# EasyEDA Pro project thermostat_hardwork.epro

# Schematic Schematic1
Create Date: 2024-04-29; Page Name: P1; Project Name: 恒温箱; Schematic Name: Schematic1; Update Date: 2024-04-30; Page Size: A3; Version: V1.0
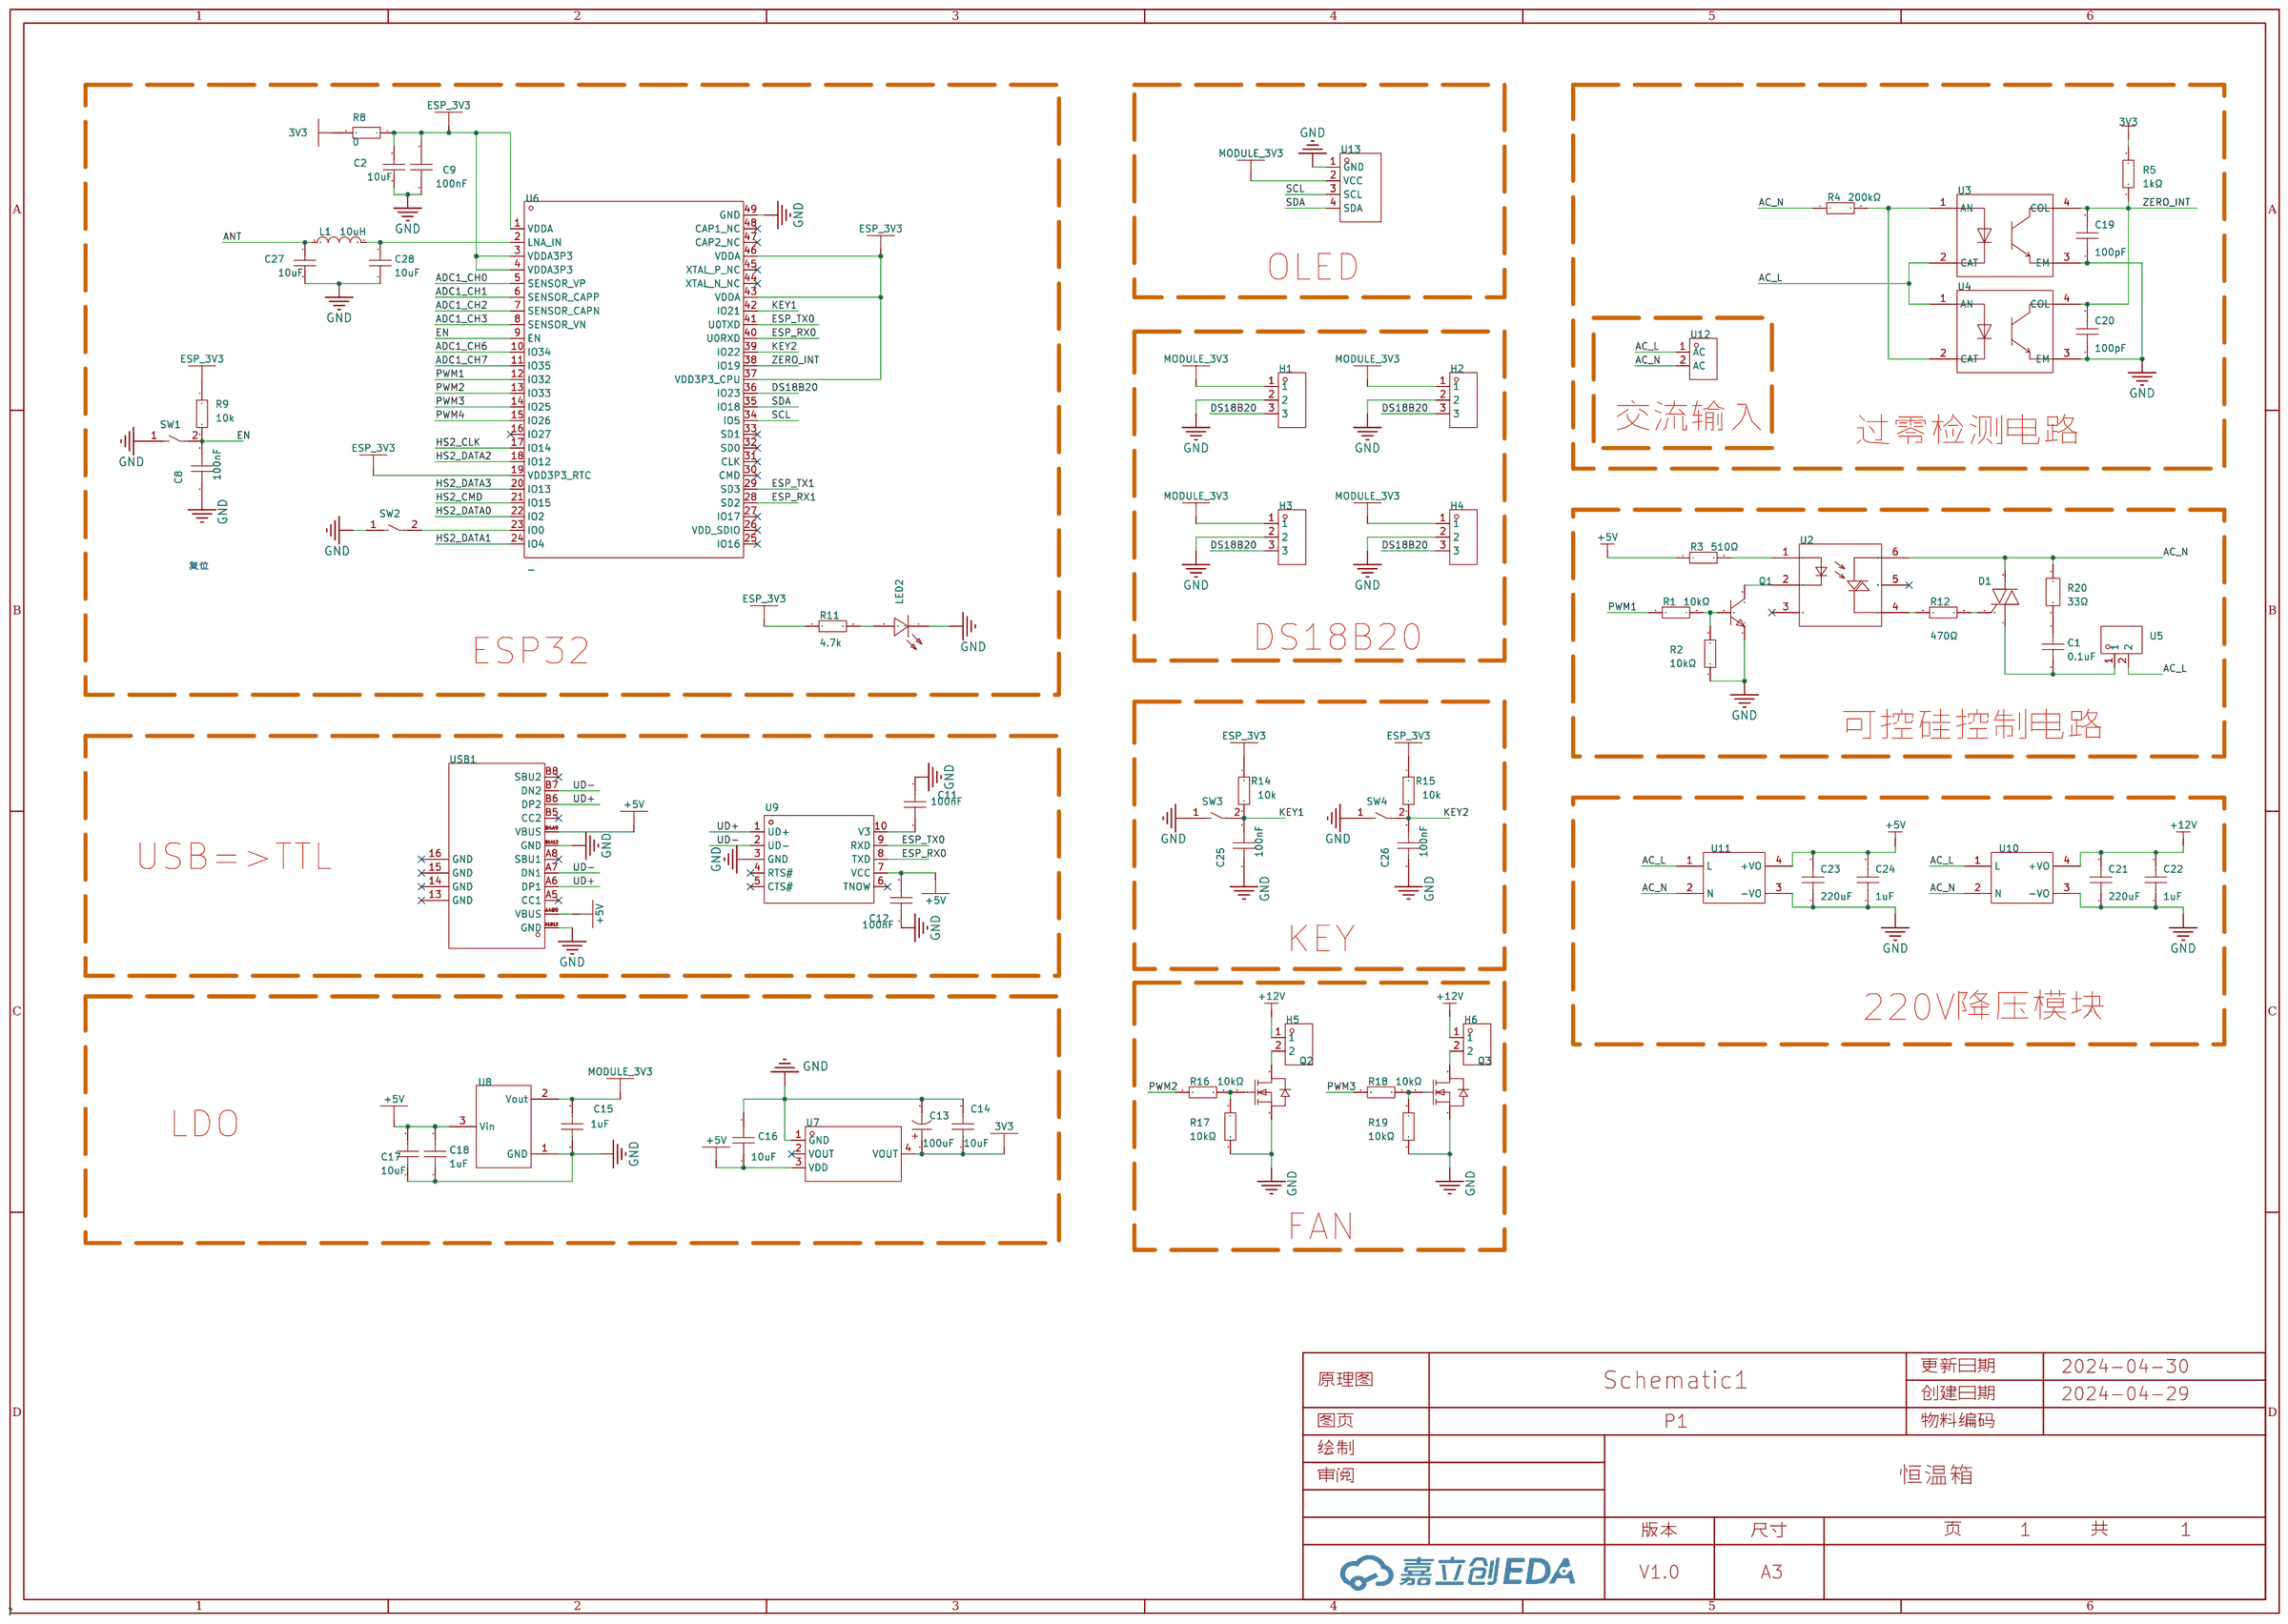
[diagram p0: schematic sheet]

## Parts
C1  0.1uF  [C1210]
C2  10uF  [C0402]
C8  100nF  [C0402]
C9  100nF  [C0402]
C11  100nF  [C0402]
C12  100nF  [C0402]
C13  100uF  [cap-smd_l3.5-w2.8-fd]
C14  10uF  [c0603]
C15  1uF  [C0402]
C16  10uF  [c0603]
C17  10uF  [c0603]
C18  1uF  [C0402]
C19  100pF  [C0402]
C20  100pF  [C0402]
C21  220uF  [C0402]
C22  1uF  [C0402]
C23  220uF  [C0402]
C24  1uF  [C0402]
C25  100nF  [C0402]
C26  100nF  [C0402]
C27  10uF  [C0402]
C28  10uF  [C0402]
D1  BT136S  [TO-252-3_L6.5-W5.8-P4.58-BL]
H1  PZ254V-11-03P  [HDR-TH_3P-P2.54-V-M]
H2  PZ254V-11-03P  [HDR-TH_3P-P2.54-V-M]
H3  PZ254V-11-03P  [HDR-TH_3P-P2.54-V-M]
H4  PZ254V-11-03P  [HDR-TH_3P-P2.54-V-M]
H5  PZ254V-11-02P  [HDR-TH_2P-P2.54-V-M]
H6  PZ254V-11-02P  [HDR-TH_2P-P2.54-V-M]
L1  10uH  [L0603]
LED2  -  [led0402-rd]
Q1  S8050  [SOT-23-3_L2.9-W1.3-P1.90-LS2.4-BR]
Q2  AO3400A  [SOT-23-3_L2.9-W1.6-P1.90-LS2.8-BR]
Q3  AO3400A  [SOT-23-3_L2.9-W1.6-P1.90-LS2.8-BR]
R1  10kΩ  [R0603]
R2  10kΩ  [R0603]
R3  510Ω  [R0603]
R4  200kΩ  [R0603]
R5  1kΩ  [R0603]
R8  0  [r0402]
R9  10k  [r0402]
R11  4.7k  [r0402]
R12  470Ω  [R1206]
R14  10k  [r0402]
R15  10k  [r0402]
R16  10kΩ  [R0603]
R17  10kΩ  [R0603]
R18  10kΩ  [R0603]
R19  10kΩ  [R0603]
R20  33Ω  [RES-SMD_L6.4-W3.2-R2512]
SW1  -  [sw-smd_l4.0-w2.9-ls5.0]
SW2  -  [sw-smd_l4.0-w2.9-ls5.0]
SW3  -  [sw-smd_l4.0-w2.9-ls5.0]
SW4  -  [sw-smd_l4.0-w2.9-ls5.0]
U2  MOC3052SM  [SMD-6_L7.1-W6.5-P2.54-LS10.3-TL]
U3  TLP521-1XSM  [SMD-4_L4.6-W6.5-P2.54-LS10.2-BL]
U4  TLP521-1XSM  [SMD-4_L4.6-W6.5-P2.54-LS10.2-BL]
U5  KF7.62-2P(green)  [CONN-TH_2P-P7.62_KEFA_KF7.62-2P]
U6  -  [qfn-48_l7.0-w7.0-p0.50-bl-ep5.4_2]
U7  -  [sot-223_l6.5-w3.5-p2.30-ls7.0-br]
U8  -  [SOT-23-3_L2.9-W1.6-P1.90-LS2.8-BR]
U9  -  [MSOP-10_L3.0-W3.0-P0.50-LS5.0-BL]
U10  -  [GJ_W_]
U11  -  [GJ_W_]
U12  RT-C06-A1B-AC  [CONN-TH_LEGION_RT-C06-A1B-AC]
U13  HS96L03W2C03  [OLED-TH_L27.8-W27.2-P2.54_C9900033791]
USB1  -  [USB-C-SMD_TYPEC-304-BCP16]

## Library data of the parts
C1 = C3225C0G2E103JT000N: 容值:10nF;精度:±5%;额定电压:250V;材质(温度系数):C0G;; LCSC Part Name: 10nF ±5% 250V; Supplier Part: C342725; Manufacturer: TDK; Supplier Footprint: 1210; JLCPCB Part Class: 扩展库; Datasheet: https://atta.szlcsc.com/upload/public/pdf/source/20191028/C441477_722A9436F63B689BB01D466E49BFBC99.pdf; Supplier: LCSC; Tolerance: ±5%; Voltage Rated: 250V; Temperature Coefficient: C0G
C2 C27 C28 = CC0402MRX5R5BB106: 容值:10uF;精度:±20%;额定电压:6.3V;温度系数:X5R;; LCSC Part Name: 10uF ±20% 6.3V; Supplier Part: C105884; Manufacturer: YAGEO(国巨); Supplier Footprint: 0402; JLCPCB Part Class: Extended Part; Datasheet: https://atta.szlcsc.com/upload/public/pdf/source/20170728/C105884_1501225684064848716.pdf; Supplier: LCSC; Tolerance: ±20%; Voltage Rated: 6.3V; Temperature Coefficient: X5R
C8 C9 C11 C12 C19-C26 = CC0402JRX7R7BB104: 容值:100nF;精度:±5%;额定电压:16V;温度系数:X7R;; LCSC Part Name: 100nF ±5% 16V; Supplier Part: C541464; Manufacturer: YAGEO(国巨); Supplier Footprint: 0402; JLCPCB Part Class: Extended Part; Datasheet: https://atta.szlcsc.com/upload/public/pdf/source/20200615/C541464_B57AABC9570B6B2CE091E735F96B12C0.pdf; Supplier: LCSC; Tolerance: ±5%; Voltage Rated: 16V; Temperature Coefficient: X7R
C13 = CA45B-B-6.3V-100uF-M: 容值:100uF;精度:±20%;额定电压:6.3V;等效串联电阻:-;工作温度:-55~+125;; LCSC Part Name: 100uF ±20% 6.3V; Supplier Part: C688948; Manufacturer: CEC(振华新云); Supplier Footprint: SMD; JLCPCB Part Class: Extended Part; Datasheet: https://atta.szlcsc.com/upload/public/pdf/source/20200701/C688948_1FC438FC63FEA69AA99F86026A33A9DC.pdf; Supplier: LCSC; Tolerance: ±20%; Rated Voltage: 6.3V; Operating Temperature: -55~+125
C14 C16 C17 = CL10A106KP8NNNC: 容值:10uF;精度:±10%;额定电压:10V;温度系数:X5R;; LCSC Part Name: 10uF ±10% 10V; Supplier Part: C19702; Manufacturer: SAMSUNG(三星); Supplier Footprint: 0603; JLCPCB Part Class: Basic Part; Datasheet: https://atta.szlcsc.com/upload/public/pdf/source/20160103/1457707703378.pdf; Supplier: LCSC; Tolerance: ±10%; Voltage Rated: 10V; Temperature Coefficient: X5R
C15 C18 = GRM155Z71A105KE01D: 容值:1uF;精度:±10%;额定电压:10V;温度系数:X7R;; LCSC Part Name: 1uF ±10% 10V; Supplier Part: C528974; Manufacturer: muRata(村田); Supplier Footprint: 0402; JLCPCB Part Class: Extended Part; Datasheet: https://atta.szlcsc.com/upload/public/pdf/source/20200508/C528974_15BC5D9F0CC13FAE313D74FE55DE6D9B.pdf; Supplier: LCSC; Tolerance: ±10%; Voltage Rated: 10V; Temperature Coefficient: X7R
D1 = BT136S: 长电双向可控硅; Supplier Part: C23427; Manufacturer: CJ(江苏长电/长晶); Supplier Footprint: TO-252-2(DPAK); JLCPCB Part Class: 扩展库; Datasheet: https://atta.szlcsc.com/upload/public/pdf/source/20131225/1457706665454.pdf; Supplier: LCSC
H1-H4 = PZ254V-11-03P: 插针结构:1x3P;间距:2.54mm;行距:-;圆针/方针:方针;安装类型:直插;排数:单排;总PIN位数:3P;额定电流:3A;额定电压:250V;配合针长度:6mm;塑高:2.5mm;端接针长度:3mm;工作温度范围:-40℃~+105℃;颜色:黑色;; LCSC Part Name: 间距:2.54mm 1x3P 直插 方针; Supplier Part: C2937625; Manufacturer: XFCN(兴飞); Supplier Footprint: 插件,P=2.54mm; JLCPCB Part Class: 扩展库; Datasheet: https://atta.szlcsc.com/upload/public/pdf/source/20200309/C492402_8335C3D49C4E4C618838D59BB1D024C1.pdf; Supplier: LCSC; Pin Structure: 1x3P; Pitch: 2.54mm; Circluar Pins/Square Pins: 方针; Mounting Type: 直插; Number of Rows: 单排; Number of Pins: 3P; Current Rating (Max): 3A; Voltage Rating (Max): 250V; Length of Mating Pin: 6mm; Insulation Height: 2.5mm; Length of End Connection Pin: 3mm; Operating Temperature Range: -40℃~+105℃; Color: 黑色
H5 H6 = PZ254V-11-02P: 插针结构:1x2P;间距:2.54mm;行距:-;圆针/方针:方针;安装类型:直插;排数:单排;总PIN位数:2P;额定电流:-;额定电压:-;配合针长度:6mm;塑高:2.5mm;端接针长度:3mm;触头材质:黄铜;触头镀层:-;工作温度范围:-40℃~+105℃;颜色:黑色;; LCSC Part Name: 间距:2.54mm 1x2P 直插 方针; Supplier Part: C492401; Manufacturer: XFCN(兴飞); Supplier Footprint: 插件,P=2.54mm; JLCPCB Part Class: 扩展库; Datasheet: https://atta.szlcsc.com/upload/public/pdf/source/20200309/C492401_A812433581A9B211A7FFA413ADDFF0E5.pdf; Supplier: LCSC; Pin Structure: 1x2P; Pitch: 2.54mm; Circluar Pins/Square Pins: 方针; Mounting Type: 直插; Number of Rows: 单排; Number of Pins: 2P; Length of Mating Pin: 6mm; Insulation Height: 2.5mm; Length of End Connection Pin: 3mm; Contact Material: 黄铜; Operating Temperature Range: -40℃~+105℃; Color: 黑色
L1 = AHW1608FE100KTF: 电感值:10uH;精度:±10%;额定电流:280mA;直流电阻(DCR):2.4Ω;; LCSC Part Name: 10uH ±10%; Supplier Part: C6808014; Manufacturer: APV(爱普微); Supplier Footprint: 0603; JLCPCB Part Class: 扩展库; Datasheet: https://atta.szlcsc.com/upload/public/pdf/source/20230801/BB08BAF005D51D8CB3E22DF937F0D567.pdf; Supplier: LCSC; Tolerance: ±10%; Rated Current: 280mA; DC Resistance (DCR): 2.4Ω; Q @ Freq: 14; Frequency - Self Resonant: 36MHz; Type: 绕线片式电感
LED2 = NCD0402G1: 发光颜色:翠绿;; LCSC Part Name: 翠绿; Supplier Part: C130723; Manufacturer: 国星光电; Supplier Footprint: 0402; JLCPCB Part Class: Extended Part; Datasheet: https://atta.szlcsc.com/upload/public/pdf/source/20200820/C130723_D39B4171A1B8D8D2F39C1DC521C0922A.pdf; Supplier: LCSC; Emitted Color: 翠绿
Q1 = S8050_C2891804: 晶体管类型:NPN;集电极电流(Ic):500mA;集射极击穿电压(Vceo):25V;功率(Pd):300mW;; LCSC Part Name: NPN 电流:500mA 耐压:25V; Supplier Part: C2891804; Manufacturer: YONGYUTAI(永裕泰); Supplier Footprint: SOT-23; JLCPCB Part Class: 扩展库; Datasheet: https://atta.szlcsc.com/upload/public/pdf/source/20210901/5347316A10609C628D4D69AE01446E5B.pdf; Supplier: LCSC; Transistor Type: NPN; Collector Current (Ic): 500mA; Collector-Emitter Breakdown Voltage (Vceo): 25V; Power Dissipation (Pd): 300mW; Collector Cut-Off Current (Icbo): 1uA; Collector-Emitter Saturation Voltage (VCE(sat)@Ic,Ib): 500mV@500mA,50mA
Q2 Q3 = AO3400A_C20917: 类型:1个N沟道;漏源电压(Vdss):30V;连续漏极电流(Id):5.7A;功率(Pd):1.4W;导通电阻(RDS(on)@Vgs,Id):26.5mΩ@10V,5.7A;阈值电压(Vgs(th)@Id):1.5V@250uA;; LCSC Part Name: 1个N沟道 耐压:30V 电流:5.7A; Supplier Part: C20917; Manufacturer: AOS; Supplier Footprint: SOT-23-3L; JLCPCB Part Class: 基础库; Datasheet: https://atta.szlcsc.com/upload/public/pdf/source/20140107/1457706668533.pdf; Supplier: LCSC; Type: 1个N沟道; Drain Source Voltage (Vdss): 30V; Continuous Drain Current (Id): 5.7A; Power Dissipation (Pd): 1.4W; Drain Source On Resistance (RDS(on)@Vgs,Id): 26.5mΩ@10V,5.7A; Gate Threshold Voltage (Vgs(th)@Id): 1.5V@250uA; Total Gate Charge (Qg@Vgs): 7nC@4.5V; Input Capacitance (Ciss@Vds): 630pF@15V; Operating Temperature: -55℃~+150℃@(Tj)
R1-R3 R16-R19 = 0603WAF1002T5E: 电阻类型:厚膜电阻;阻值:10kΩ;精度:±1%;功率:100mW;最大工作电压:75V;温度系数:±100ppm/℃;; LCSC Part Name: 厚膜电阻 10kΩ ±1% 100mW; Supplier Part: C25804; Manufacturer: UNI-ROYAL(厚声); Supplier Footprint: 0603; JLCPCB Part Class: 基础库; Datasheet: https://atta.szlcsc.com/upload/public/pdf/source/20200306/C422600_1E6D84923E4A46A82E41ADD87F860B5C.pdf; Supplier: LCSC; Type: 厚膜电阻; Tolerance: ±1%; Power(Watts): 100mW; Overload Voltage (Max): 75V; Temperature Coefficient: ±100ppm/℃; Operating Temperature Range: -55℃~+155℃
R4 = 0603WAF2003T5E: 电阻类型:厚膜电阻;阻值:200kΩ;精度:±1%;功率:100mW;最大工作电压:75V;温度系数:±100ppm/℃;; LCSC Part Name: 200kΩ ±1% 100mW 厚膜电阻; Supplier Part: C25811; Manufacturer: UNI-ROYAL(厚声); Supplier Footprint: 0603; JLCPCB Part Class: 基础库; Datasheet: https://atta.szlcsc.com/upload/public/pdf/source/20200306/C422600_1E6D84923E4A46A82E41ADD87F860B5C.pdf; Supplier: LCSC; Type: 厚膜电阻; Tolerance: ±1%; Power(Watts): 100mW; Overload Voltage (Max): 75V; Temperature Coefficient: ±100ppm/℃; Operating Temperature Range: -55℃~+155℃
R5 = RC0603FR-071KL: 电阻类型:厚膜电阻;阻值:1kΩ;精度:±1%;功率:100mW;最大工作电压:75V;温度系数:±100ppm/℃;; LCSC Part Name: 厚膜电阻 1kΩ ±1% 100mW; Supplier Part: C22548; Manufacturer: YAGEO(国巨); Supplier Footprint: 0603; JLCPCB Part Class: 扩展库; Datasheet: https://atta.szlcsc.com/upload/public/pdf/source/20180316/70C0E2BDAE7FCC62C531A5A58D202EE1.pdf; Supplier: LCSC; Type: 厚膜电阻; Tolerance: ±1%; Power(Watts): 100mW; Overload Voltage (Max): 75V; Temperature Coefficient: ±100ppm/℃; Operating Temperature Range: -55℃~+155℃
R8 = 0402WGJ0000TCE: 电阻类型:厚膜电阻;阻值:0;精度:±5%;功率:1/16W;温度系数:-;最大工作电压:50V;工作温度范围:-55~+155;; LCSC Part Name: 0 ±5%; Supplier Part: C21376; Manufacturer: UNI-ROYAL(厚声); Supplier Footprint: 0402; JLCPCB Part Class: Extended Part; Datasheet: https://atta.szlcsc.com/upload/public/pdf/source/20200306/C422600_1E6D84923E4A46A82E41ADD87F860B5C.pdf; Supplier: LCSC; Type: 厚膜电阻; Tolerance: ±5%; Power(Watts): 1/16W; Overload Voltage (Max): 50V; Operating Temperature Range: -55~+155
R9 R14 R15 = AC0402FR-0710KL: 电阻类型:厚膜电阻;阻值:10k;精度:±1%;功率:62.5mW;温度系数:±100ppm/;最大工作电压:50V;工作温度范围:-55~+155;; LCSC Part Name: 10k ±1%; Supplier Part: C144807; Manufacturer: YAGEO(国巨); Supplier Footprint: 0402; JLCPCB Part Class: Extended Part; Datasheet: https://atta.szlcsc.com/upload/public/pdf/source/20171225/C144807_15141880815031202999.pdf; Supplier: LCSC; Type: 厚膜电阻; Tolerance: ±1%; Power(Watts): 62.5mW; Temperature Coefficient: ±100ppm/; Overload Voltage (Max): 50V; Operating Temperature Range: -55~+155
R11 = AC0402FR-074K7L: 电阻类型:厚膜电阻;阻值:4.7k;精度:±1%;功率:62.5mW;温度系数:±100ppm/;最大工作电压:50V;工作温度范围:-55~+155;; LCSC Part Name: 4.7k ±1%; Supplier Part: C174364; Manufacturer: YAGEO(国巨); Supplier Footprint: 0402; JLCPCB Part Class: Extended Part; Datasheet: https://atta.szlcsc.com/upload/public/pdf/source/20180125/C174364_15168701759061304793.pdf; Supplier: LCSC; Type: 厚膜电阻; Tolerance: ±1%; Power(Watts): 62.5mW; Temperature Coefficient: ±100ppm/; Overload Voltage (Max): 50V; Operating Temperature Range: -55~+155
R12 = 1206W4F220JT5E: 电阻类型:厚膜电阻;阻值:22Ω;精度:±1%;功率:250mW;最大工作电压:200V;温度系数:±100ppm/℃;; LCSC Part Name: 22Ω ±1% 250mW 厚膜电阻; Supplier Part: C17958; Manufacturer: UNI-ROYAL(厚声); Supplier Footprint: 1206; JLCPCB Part Class: 基础库; Datasheet: https://atta.szlcsc.com/upload/public/pdf/source/20200306/C422600_1E6D84923E4A46A82E41ADD87F860B5C.pdf; Supplier: LCSC; Type: 厚膜电阻; Tolerance: ±1%; Power(Watts): 250mW; Overload Voltage (Max): 200V; Temperature Coefficient: ±100ppm/℃; Operating Temperature Range: -55℃~+155℃
R20 = HoJLR2512-3W-10mR-1%: 电阻类型:采样电阻;阻值:10mΩ;精度:±1%;功率:3W;安装方式:贴片;; LCSC Part Name: 10mΩ ±1% 3W; Supplier Part: C2903468; Manufacturer: Milliohm(毫欧); Supplier Footprint: 2512; JLCPCB Part Class: 扩展库; Datasheet: https://atta.szlcsc.com/upload/public/pdf/source/20211009/7525CABAB363C979E942C1DD41F1FEF0.pdf; Supplier: LCSC; Type: 采样电阻; Tolerance: ±1%; Power(Watts): 3W; Mounting Sytle: 贴片
SW1-SW4 = TS342A2P 250gf-WZ 021: 3*4正按小龟 2脚/两脚贴片小龟 无柱/不带柱; LCSC Part Name: 轻触开关 正按小龟 3*4*2mm 两脚不带柱 250gf 黑色塑胶按钮; Supplier Part: C2906285; Manufacturer: SHOU HAN(首韩); Supplier Footprint: SMD; JLCPCB Part Class: Extended Part; Datasheet: https://atta.szlcsc.com/upload/public/pdf/source/20211019/B0840D9D2EDA6B165E59EB2CD177CDC8.pdf; Supplier: LCSC
U2 = MOC3052SM: Supplier Part: C3014301; Manufacturer: UMW(友台半导体); Supplier Footprint: SOP-6-6.5mm; JLCPCB Part Class: 扩展库; Datasheet: https://atta.szlcsc.com/upload/public/pdf/source/20231109/FEF2BBB42FEEF1333F7A621F5DB25FD4.pdf; Supplier: LCSC
U3 U4 = TLP521-1XSM: 输入电压类型:DC;正向电压:1.15V;输出电流:50mA;隔离电压(rms):5.3kV;反向电压:6V;接收端电压:55V;输出通道数:1;集射极饱和电压(Vce(sat)@Ic,IF):400mV@2.4mA,8mA;; LCSC Part Name: DC输入 隔离电压(rms):5300V; Supplier Part: C83157; Manufacturer: ISOCOM(英国安数光); Supplier Footprint: SMD-4P; JLCPCB Part Class: 扩展库; Datasheet: https://atta.szlcsc.com/upload/public/pdf/source/20181205/C83157_755450129BF4CC137580CACDD5B9451F.pdf; Supplier: LCSC; Input voltage type: DC; Output Type: 光电三极管; Forward Voltage: 1.15V; Output Current: 50mA; Isolation Voltage(rms): 5.3kV; Reverse Voltage: 6V; Receiving End Voltage: 55V; Number of Outputs: 1; Collector-Emitter Saturation Voltage (Vce(sat)@Ic,IF): 400mV@2.4mA,8mA; Rise time: 4us@2mA,100Ω; Fall time: 3us@2mA,100Ω; Operating Temperature: -30℃~+100℃
U5 = KF7.62-2P(green): LCSC Part Name: KF7.62-2P(green) 绿色尼龙环保; Supplier Part: C5173665; Manufacturer: KEFA(科发); Supplier Footprint: 插件,P=7.62mm; JLCPCB Part Class: 扩展库; Datasheet: https://atta.szlcsc.com/upload/public/pdf/source/20220915/0842C98F0805CE3BBD42ED115252704B.pdf; Supplier: LCSC
U6 = ESP32-PICO-D4: 类型:-;作业频率:-;输出功率:-;接口类型:-;工作电压:-;; Supplier Part: C193707; Manufacturer: ESPRESSIF 乐鑫; Supplier Footprint: QFN-48_7x7x05P; JLCPCB Part Class: Extended Part; Datasheet: https://atta.szlcsc.com/upload/public/pdf/source/20180531/C193707_20E6BADDB6EC95F0C0D505BA515D2866.pdf; Supplier: LCSC
U7 = BL8071CLBTR33: 输出类型:-;; Supplier Part: C2763399; Manufacturer: BL(上海贝岭); Supplier Footprint: SOT-223(B); JLCPCB Part Class: Extended Part; Datasheet: https://atta.szlcsc.com/upload/public/pdf/source/20210326/C2763399_673FCA3A6B3A739A2977F0E56E5ED7A1.pdf; Supplier: LCSC
U8 = XC6206P332MR_C5446: 输出类型:固定;输出极性:正;输出通道数:1;最大输入电压:6V;输出电压:3.3V;压差:680mV@(100mA);输出电流:200mA;电源纹波抑制比(PRSS):-;; LCSC Part Name: Vin=6V Vout=3.3V 200mA; Supplier Part: C5446; Manufacturer: TOREX(特瑞仕); Manufacturer Part: XC6206P332MR; Supplier Footprint: SOT-23-3L; JLCPCB Part Class: Basic Part; Datasheet: https://atta.szlcsc.com/upload/public/pdf/source/20130801/1457706628791.pdf; Supplier: LCSC; Output Type: 固定; Output Polarity: 正; Number of Outputs: 1; Maximum Input Voltage: 6V; Output Voltage: 3.3V; Dropout Voltage: 680mV@(100mA); Output Current: 200mA
U9 = CH340E: 类型:Transceiver;协议类别:USB 2.0;驱动器/接收器数:-;数据速率:2Mbps;; Supplier Part: C99652; Manufacturer: WCH(南京沁恒); Supplier Footprint: MSOP-10; JLCPCB Part Class: Extended Part; Datasheet: https://atta.szlcsc.com/upload/public/pdf/source/20200819/C99652_97FFC0DF2539BFF05CD752AD9221D632.pdf; Supplier: LCSC; Type: Transceiver; Protocol: USB 2.0; Data Rate: 2Mbps; Supply Voltage: 3.3V, 5V
U10 U11 = GJ_W_: 220V降压模块
U12 = RT-C06-A1B-AC_C18221846: 带安规认证米老鼠三孔插座1.Rating：2.5A 250VAC UL CUL; Supplier Part: C18221846; Manufacturer: Legion(六钧); Supplier Footprint: 插件; Datasheet: https://atta.szlcsc.com/upload/public/pdf/source/20231012/B6CE6CE5EB936751B4418C0730F2656A.pdf; Supplier: LCSC
U13 = HS96L03W2C03: 主控芯片:SSD1315;接口类型:I2C;尺寸(inch):0.96;像素分辨率:128x64;; LCSC Part Name: 0.96寸OLED显示屏窄白光IIC; Supplier Part: C5248080; Manufacturer: HS(汉昇); JLCPCB Part Class: 扩展库; Datasheet: https://atta.szlcsc.com/upload/public/pdf/source/20230627/763D01F79A90007632F098068C7C8AD9.pdf; Supplier: LCSC; Main Control Chip: SSD1315; Interface Type: I2C; Size: 0.96; Pixel Resolution: 128x64; Operating Temperature: -40℃~+70℃
USB1 = TYPEC-304-BCP16: 连接器类型:Type-C;标准:USB 3.1;公母:母座;触点数量:16.0;端口数量:1;安装方式:卧贴;额定电流 - 电源:3A;工作温度范围:-25~+85;焊接温度(最大值):260;; Supplier Part: C720629; Manufacturer: XUNPU(讯普); Supplier Footprint: SMD; JLCPCB Part Class: Extended Part; Datasheet: https://atta.szlcsc.com/upload/public/pdf/source/20211022/DACD6552F639E9483017DE6DC0E61150.pdf; Supplier: LCSC; Connector Type: Type-C; Standard: USB 3.1; Gender: 母座; Number of Contacts: 16.0; Number of Ports: 1; Mounting Sytle: 卧贴; Current Rating - Power (Max): 3A; Operating Temperature Range: -25~+85; Welding Temperature (Max): 260

## Nets
3V3: C13.1 C14.1 R5.2 R8.2 U7.4(VOUT)
+5V: C12.2 C16.1 C17.2 C18.2 C23.2 C24.2 R3.1 U7.3(VDD) U8.3(Vin) U9.7(VCC) U11.4(+VO) USB1.A4B9(VBUS) USB1.B4A9(VBUS)
+12V: C21.2 C22.2 H5.1 H6.1 U10.4(+VO)
GND: C2.1 C8.1 C9.1 C11.2 C12.1 C13.2 C14.2 C15.1 C16.2 C17.1 C18.1 C19.1 C20.1 C21.1 C22.1 C23.1 C24.1 C25.1 C26.1 C27.1 C28.1 H1.2 H2.2 H3.2 H4.2 LED2.1(K) Q1.2(E) Q2.2(S) Q3.2(S) R2.1 R17.1 R19.1 SW1.1 SW2.1 SW3.1 SW4.1 U3.3(EM) U4.3(EM) U6.49(GND) U7.1(GND) U8.1(GND) U9.3(GND) U10.3(-VO) U11.3(-VO) U13.1(GND) USB1.A1B12(GND) USB1.B1A12(GND)
AC_L: U3.2(CAT) U4.1(AN) U5.2 U10.1(L) U11.1(L) U12.1(AC)
AC_N: D1.2(M2) R4.1 R20.1 U2.6(Terminal) U10.2(N) U11.2(N) U12.2(AC)
ADC1_CH0: U6.5(SENSOR_VP)
ADC1_CH1: U6.6(SENSOR_CAPP)
ADC1_CH2: U6.7(SENSOR_CAPN)
ADC1_CH3: U6.8(SENSOR_VN)
ADC1_CH6: U6.10(IO34)
ADC1_CH7: U6.11(IO35)
ANT: C27.2 L1.1
DS18B20: H1.3 H2.3 H3.3 H4.3 U6.36(IO23)
EN: C8.2 R9.2 SW1.2 U6.9(EN)
ESP_3V3: C2.2 C9.2 R8.1 R9.1 R11.1 R14.1 R15.1 U6.1(VDDA) U6.3(VDDA3P3) U6.4(VDDA3P3) U6.19(VDD3P3_RTC) U6.37(VDD3P3_CPU) U6.43(VDDA) U6.46(VDDA)
ESP_RX0: U6.40(U0RXD) U9.8(TXD)
ESP_RX1: U6.28(SD2)
ESP_TX0: U6.41(U0TXD) U9.9(RXD)
ESP_TX1: U6.29(SD3)
HS2_CLK: U6.17(IO14)
HS2_CMD: U6.21(IO15)
HS2_DATA0: U6.22(IO2)
HS2_DATA1: U6.24(IO4)
HS2_DATA2: U6.18(IO12)
HS2_DATA3: U6.20(IO13)
KEY1: C25.2 R14.2 SW3.2 U6.42(IO21)
KEY2: C26.2 R15.2 SW4.2 U6.39(IO22)
MODULE_3V3: C15.2 H1.1 H2.1 H3.1 H4.1 U8.2(Vout) U13.2(VCC)
PWM1: R1.1 U6.12(IO32)
PWM2: R16.1 U6.13(IO33)
PWM3: R18.1 U6.14(IO25)
PWM4: U6.15(IO26)
SCL: U6.34(IO5) U13.3(SCL)
SDA: U6.35(IO18) U13.4(SDA)
UD+: U9.1(UD+) USB1.A6(DP1) USB1.B6(DP2)
UD-: U9.2(UD-) USB1.A7(DN1) USB1.B7(DN2)
ZERO_INT: C19.2 C20.2 R5.1 U3.4(COL) U4.4(COL) U6.38(IO19)
$1N600: R3.2 U2.1(AN)
$1N603: Q1.3(C) U2.2(CAT)
$1N629: Q1.1(B) R1.2 R2.2
$1N976: R4.2 U3.1(AN) U4.2(CAT)
$1N1155: R12.1 U2.4(Terminal)
$1N1347: D1.3(G) R12.2
$1N1416: C1.2 D1.1(M1) U5.1
$1N4532: C11.1 U9.10(V3)
$1N4544: LED2.2(A) R11.2
$1N12396: SW2.2 U6.23(IO0)
$1N12986: Q2.1(G) R16.2 R17.2
$1N13035: H5.2 Q2.3(D)
$1N13251: Q3.1(G) R18.2 R19.2
$1N13257: H6.2 Q3.3(D)
$1N15091: C28.2 L1.2 U6.2(LNA_IN)
$1N16886: C1.1 R20.2

Not connected (* = marked no-connect by the designer): U2 3(NC)* 5(Substrate)*; U6 16(IO27)* 25(IO16)* 26(VDD_SDIO)* 27(IO17)* 30(CMD)* 31(CLK)* 32(SD0)* 33(SD1)* 44(XTAL_N_NC)* 45(XTAL_P_NC)* 47(CAP2_NC)* 48(CAP1_NC)*; U7 2(VOUT)*; U9 4(RTS#)* 5(CTS#)* 6(TNOW)*; USB1 13(GND)* 14(GND)* 15(GND)* 16(GND)* A5(CC1)* A8(SBU1)* B5(CC2)* B8(SBU2)*

## Notes on the sheet
- OLED
- 交流输入
- 过零检测电路
- 复位
- DS18B20
- ESP32
- 可控硅控制电路
- USB=>TTL
- KEY
- 220V降压模块
- LDO
- FAN

# Board PCB1
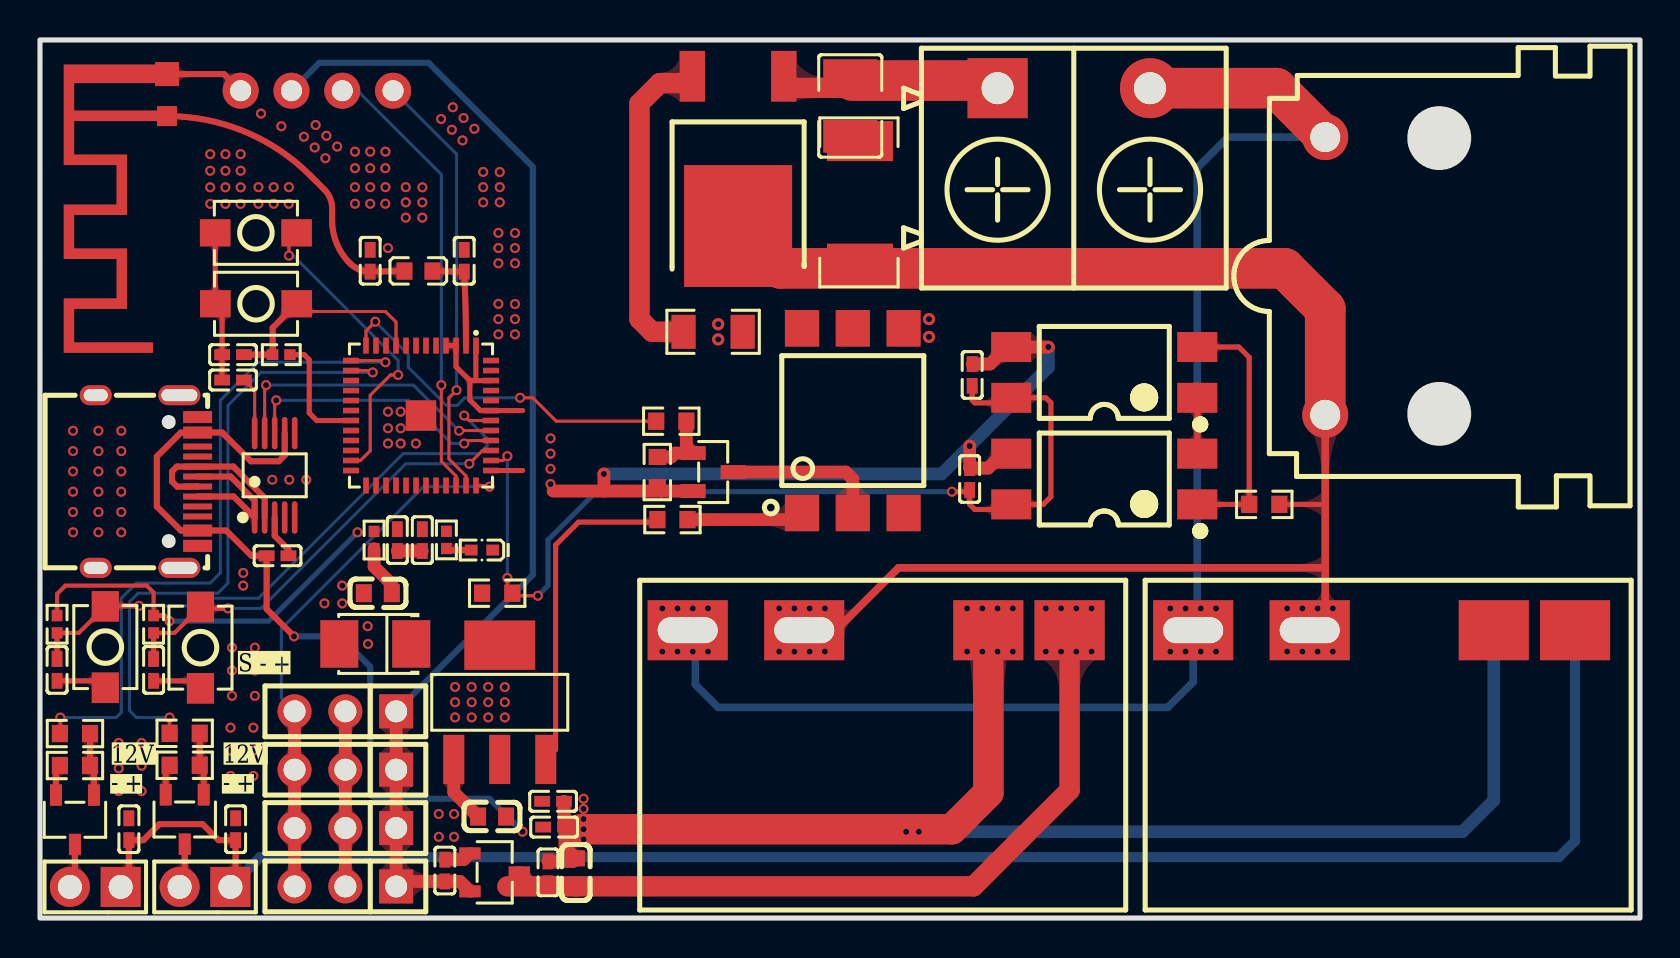
[diagram p1: board, top side]
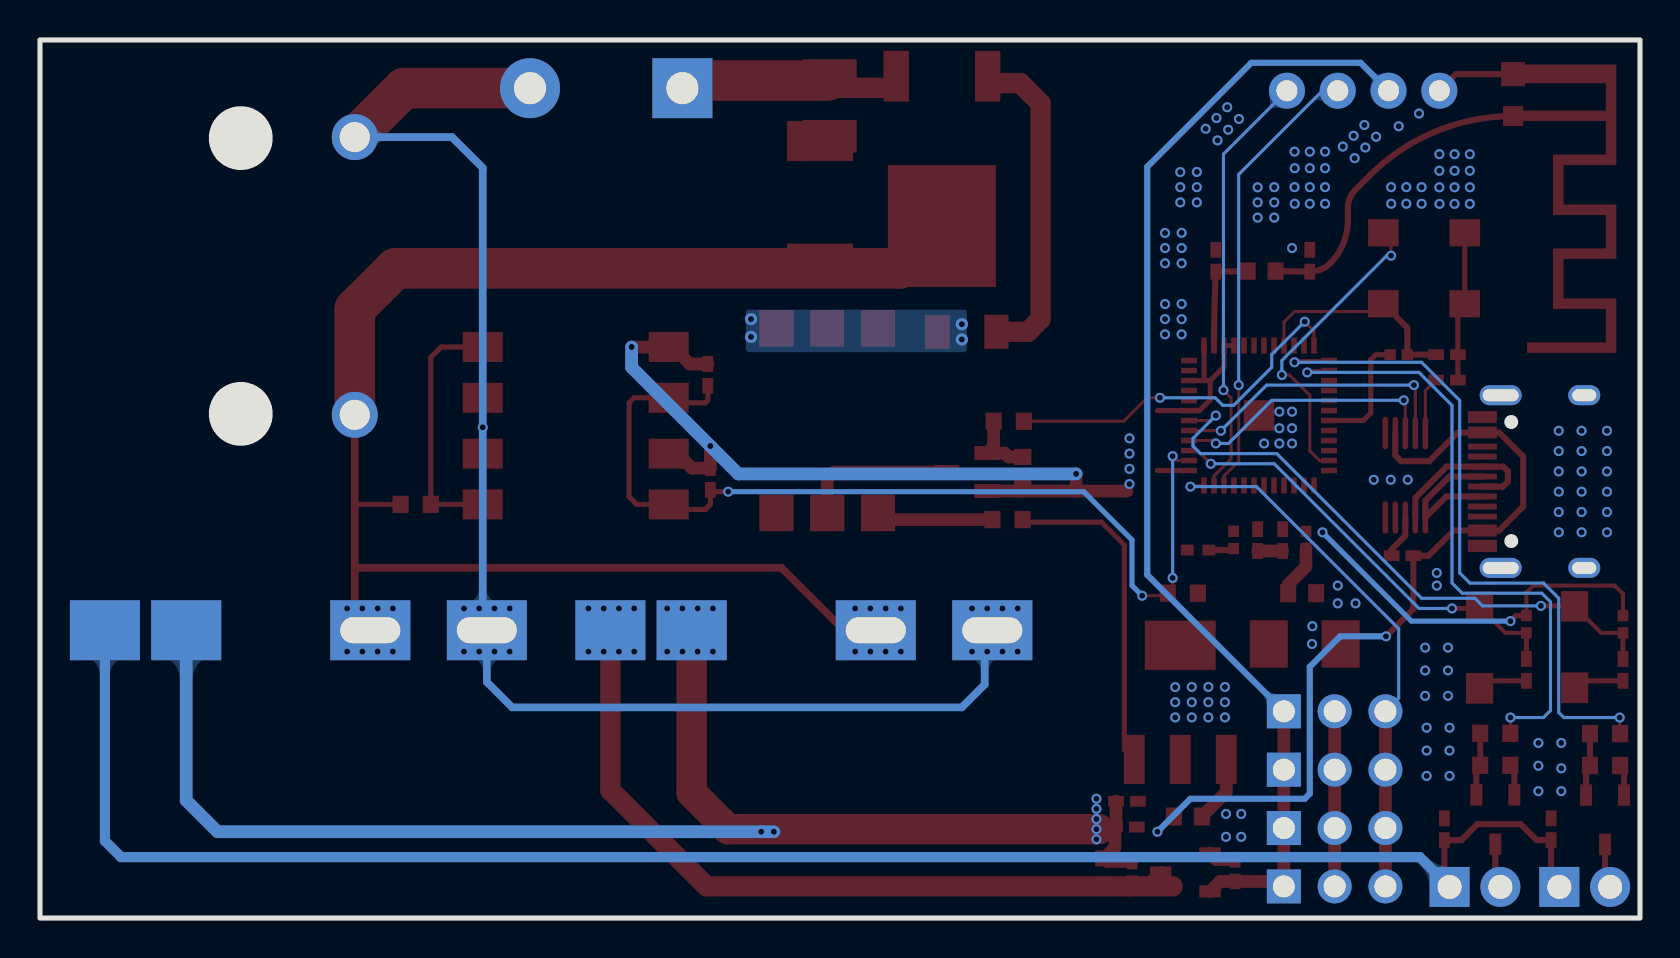
[diagram p2: board, bottom side, seen from below]

Outline 80 x 43.94 mm; copper layers: Top Layer, Bottom Layer. Coordinates in mm from the lower left corner of the outline.
Outline path: rectangle 0,43.94 80,0
Stack: Top Layer 0.035mm / Dielectric1 1.51mm FR4 er 4.5 / Bottom Layer 0.035mm

## Design rules (mm)
template: 自定义配置
spacing copperThickness1oz (default): track to track 0.102, other pairs 0.152 to 0.3
spacing copperThickness2oz: track to track 0.203, other pairs 0.152 to 0.3
track width copperThickness1oz (default): min 0.127, default 0.254, max 2.54
track width copperThickness2oz: min 0.203, default 0.254, max 2.54
differential pair differentialPair (default): width min 0.127, default 0.254, max 2.54; gap min 0.152, default 0.152
via viaSize (default): diameter min 0.5, default 0.61, max 10; hole min 0.3, default 0.305, max 6.3

## Placement (name value [footprint] x y rotation side)
C1  0.1uF  [C1210]  40.51 40.64 90 top
C2  10uF  [C0402]  17.87 18.91 90 top
C8  100nF  [C0402]  9.65 28.19 0 top
C9  100nF  [C0402]  19.12 18.91 90 top
C11  100nF  [C0402]  9.65 26.92 180 top
C12  100nF  [C0402]  11.88 18.13 180 top
C13  100uF  [cap-smd_l3.5-w2.8-fd]  16.76 13.72 180 top
C14  10uF  [c0603]  16.89 16.26 180 top
C15  1uF  [C0402]  20.24 2.38 270 top
C16  10uF  [c0603]  26.8 2.29 90 top
C17  10uF  [c0603]  22.61 5.08 0 top
C18  1uF  [C0402]  25.65 5.84 180 top
C19  100pF  [C0402]  46.61 27.18 270 top
C20  100pF  [C0402]  46.48 21.97 270 top
C21  220uF  [C0402]  9.78 4.45 270 top
C22  1uF  [C0402]  4.45 4.45 270 top
C23  220uF  [C0402]  25.4 2.29 270 top
C24  1uF  [C0402]  25.71 4.55 180 top
C25  100nF  [C0402]  0.85 12.42 90 top
C26  100nF  [C0402]  5.68 12.42 90 top
C27  10uF  [C0402]  16.51 32.89 270 top
C28  10uF  [C0402]  21.21 32.89 270 top
D1  BT136S  [TO-252-3_L6.5-W5.8-P4.58-BL]  34.9 38.38 180 top
DESIGNATOR1  -  [ANT-PCB-2.4G-IFA-AN043-TI-ORIGIN]  6.35 40.13 90 top
H1  PZ254V-11-03P  [HDR-TH_3P-P2.54-V-M]  15.27 1.58 180 top
H2  PZ254V-11-03P  [HDR-TH_3P-P2.54-V-M]  15.27 7.42 180 top
H3  PZ254V-11-03P  [HDR-TH_3P-P2.54-V-M]  15.27 4.5 180 top
H4  PZ254V-11-03P  [HDR-TH_3P-P2.54-V-M]  15.27 10.34 180 top
H5  PZ254V-11-02P  [HDR-TH_2P-P2.54-V-M]  2.76 1.56 180 top
H6  PZ254V-11-02P  [HDR-TH_2P-P2.54-V-M]  8.25 1.56 180 top
L1  10uH  [L0603]  18.92 32.38 0 top
LED2  -  [led0402-rd]  22.1 18.42 180 top
Q1  S8050  [SOT-23-3_L2.9-W1.3-P1.90-LS2.4-BR]  33.66 22.32 180 top
Q2  AO3400A  [SOT-23-3_L2.9-W1.6-P1.90-LS2.8-BR]  1.75 4.92 90 top
Q3  AO3400A  [SOT-23-3_L2.9-W1.6-P1.90-LS2.8-BR]  7.24 4.93 90 top
R1  10kΩ  [R0603]  31.56 24.86 0 top
R2  10kΩ  [R0603]  30.87 22.32 90 top
R3  510Ω  [R0603]  31.62 19.94 0 top
R4  200kΩ  [R0603]  61.21 20.7 180 top
R5  1kΩ  [R0603]  22.86 16.26 180 top
R8  0  [r0402]  16.7 18.91 270 top
R9  10k  [r0402]  12.06 28.19 180 top
R11  4.7k  [r0402]  20.32 18.92 270 top
R12  470Ω  [R1206]  33.66 29.34 180 top
R14  10k  [r0402]  0.85 14.7 270 top
R15  10k  [r0402]  5.68 14.7 270 top
R16  10kΩ  [R0603]  1.75 9.23 0 top
R17  10kΩ  [R0603]  1.75 7.63 0 top
R18  10kΩ  [R0603]  7.24 9.25 0 top
R19  10kΩ  [R0603]  7.24 7.65 0 top
R20  33Ω  [RES-SMD_L6.4-W3.2-R2512]  41 35.81 90 top
SW1  -  [sw-smd_l4.0-w2.9-ls5.0]  10.8 30.74 0 top
SW2  -  [sw-smd_l4.0-w2.9-ls5.0]  10.8 34.29 0 top
SW3  -  [sw-smd_l4.0-w2.9-ls5.0]  3.27 13.56 90 top
SW4  -  [sw-smd_l4.0-w2.9-ls5.0]  8.02 13.53 90 top
U2  MOC3052SM  [SMD-6_L7.1-W6.5-P2.54-LS10.3-TL]  40.64 24.89 90 top
U3  TLP521-1XSM  [SMD-4_L4.6-W6.5-P2.54-LS10.2-BL]  53.21 21.97 90 top
U4  TLP521-1XSM  [SMD-4_L4.6-W6.5-P2.54-LS10.2-BL]  53.21 27.31 90 top
U5  KF7.62-2P(green)  [CONN-TH_2P-P7.62_KEFA_KF7.62-2P]  51.69 41.53 0 top
U6  -  [qfn-48_l7.0-w7.0-p0.50-bl-ep5.4_2]  19.05 25.15 180 top
U7  -  [sot-223_l6.5-w3.5-p2.30-ls7.0-br]  22.99 10.8 270 top
U8  -  [SOT-23-3_L2.9-W1.6-P1.90-LS2.8-BR]  22.73 2.29 180 top
U9  -  [MSOP-10_L3.0-W3.0-P0.50-LS5.0-BL]  11.73 22.16 0 top
U10  -  [GJ_W_]  68.45 10.92 0 top
U11  -  [GJ_W_]  43.18 10.92 0 top
U12  RT-C06-A1B-AC  [CONN-TH_LEGION_RT-C06-A1B-AC]  64.26 32.13 90 top
U13  HS96L03W2C03  [OLED-TH_L27.8-W27.2-P2.54_C9900033791]  13.84 41.4 0 top
USB1  -  [USB-C-SMD_TYPEC-304-BCP16]  5.33 21.84 270 top

## Footprints (pads in the part's own frame, mm; a bottom-side part is the same pattern mirrored in y, then rotated)
ANT-PCB-2.4G-IFA-AN043-TI-ORIGIN
  rect 1x1 smd: 1(0,0)
  rect 1.2x1.2 smd: 2(2.1,0)
C0402
  rect 0.79x0.541 smd: 1(-0.546,0) 2(0.546,0)
c0603
  rect 0.8x0.9 smd: 1(-0.7,0) 2(0.7,0)
C1210
  rect 1.635x2.7 smd: 1(-1.518,0) 2(1.518,0)
cap-smd_l3.5-w2.8-fd
  rect 1.9x2.375 smd: 1(-1.798,0) 2(1.798,0)
CONN-TH_2P-P7.62_KEFA_KF7.62-2P
  rect 3x3 hole 1.6: 1(-3.81,0)
  round 3 hole 1.6: 2(3.81,0)
CONN-TH_LEGION_RT-C06-A1B-AC
  round 2.3 hole 1.5: 1(6.95,0) 2(-6.95,0)
GJ_W_
  rect 4x3 hole 3x1.3: 1(-10.795,3.482) 2(-4.968,3.482)
  rect 3.5x3 hole 0.003: 3(4.237,3.482) 4(8.301,3.482)
  round 0.003 hole 6.2x1.3: 5(6.269,3.482)
HDR-TH_2P-P2.54-V-M
  rect 2x2 hole 1.2: 1(-1.27,0)
  round 2 hole 1.2: 2(1.27,0)
HDR-TH_3P-P2.54-V-M
  rect 1.7x1.7 hole 1.1: 1(-2.54,0)
  round 1.7 hole 1.1: 2(0,0) 3(2.54,0)
L0603
  rect 0.8x0.864 smd: 1(-0.7,0) 2(0.7,0)
led0402-rd
  rect 0.637x0.541 smd: 1(-0.538,0) 2(0.538,0)
MSOP-10_L3.0-W3.0-P0.50-LS5.0-BL
  oval 0.28x1.621 smd: 1(-1.001,-2.111) 2(-0.5,-2.111) 3(0,-2.111) 4(0.5,-2.111) 5(1.001,-2.111) 6(1.001,2.111) 7(0.5,2.111) 8(0,2.111) 9(-0.5,2.111) 10(-1.001,2.111)
OLED-TH_L27.8-W27.2-P2.54_C9900033791
  round 1.8 hole 1.05: 1(-3.81,0) 2(-1.27,0) 3(1.27,0) 4(3.81,0)
qfn-48_l7.0-w7.0-p0.50-bl-ep5.4_2
  rect 0.28x0.8 smd: 1(-2.751,-3.5) 2(-2.251,-3.5) 3(-1.75,-3.5) 4(-1.25,-3.5) 5(-0.75,-3.5) 6(-0.249,-3.5) 7(0.249,-3.5) 8(0.75,-3.5) 9(1.25,-3.5) 10(1.75,-3.5) 11(2.251,-3.5) 12(2.751,-3.5) 25(2.751,3.5) 26(2.251,3.5) 27(1.75,3.5) 28(1.25,3.5) 29(0.75,3.5) 30(0.249,3.5) 31(-0.249,3.5) 32(-0.75,3.5) 33(-1.25,3.5) 34(-1.75,3.5) 35(-2.251,3.5) 36(-2.751,3.5)
  rect 0.8x0.28 smd: 13(3.5,-2.751) 14(3.5,-2.251) 15(3.5,-1.75) 16(3.5,-1.25) 17(3.5,-0.75) 18(3.5,-0.249) 19(3.5,0.249) 20(3.5,0.75) 21(3.5,1.25) 22(3.5,1.75) 23(3.5,2.251) 24(3.5,2.751) 37(-3.5,2.751) 38(-3.5,2.251) 39(-3.5,1.75) 40(-3.5,1.25) 41(-3.5,0.75) 42(-3.5,0.249) 43(-3.5,-0.249) 44(-3.5,-0.75) 45(-3.5,-1.25) 46(-3.5,-1.75) 47(-3.5,-2.251) 48(-3.5,-2.751)
  rect 1.524x1.524 smd: 49(0,0)
r0402
  rect 0.567x0.541 smd: 1(-0.432,0) 2(0.432,0)
R0603
  rect 0.806x0.864 smd: 1(-0.753,0) 2(0.753,0)
R1206
  rect 1.208x1.701 smd: 1(-1.479,0) 2(1.479,0)
RES-SMD_L6.4-W3.2-R2512
  rect 2x3.3 smd: 1(-3.067,0) 2(3.067,0)
SMD-4_L4.6-W6.5-P2.54-LS10.2-BL
  rect 1.5x2 smd: 1(-1.27,-4.65) 2(1.27,-4.65) 3(1.27,4.65) 4(-1.27,4.65)
SMD-6_L7.1-W6.5-P2.54-LS10.3-TL
  rect 1.83x1.71 smd: 1(-4.62,2.54) 2(-4.62,0) 3(-4.62,-2.54) 4(4.62,-2.54) 5(4.62,0) 6(4.62,2.54)
SOT-23-3_L2.9-W1.3-P1.90-LS2.4-BR
  rect 1.25x0.7 smd: 1(1,-0.95) 2(1,0.95) 3(-1,0)
SOT-23-3_L2.9-W1.6-P1.90-LS2.8-BR
  rect 1.069x0.6 smd: 1(1.234,-0.95) 2(1.234,0.95) 3(-1.234,0)
sot-223_l6.5-w3.5-p2.30-ls7.0-br
  rect 2.464x1.049 smd: 1(2.857,-2.299) 2(2.857,0) 3(2.857,2.301)
  rect 2.464x3.541 smd: 4(-2.857,0)
sw-smd_l4.0-w2.9-ls5.0
  rect 1.53x1.36 smd: 1(-2.035,0) 2(2.035,0)
TO-252-3_L6.5-W5.8-P4.58-BL
  rect 1.27x2.54 smd: 1(-2.288,-3.747) 3(2.288,-3.745)
  rect 5.4x6.1 smd: 2(-0.002,3.747)
USB-C-SMD_TYPEC-304-BCP16
  oval 1.001x2.1 hole 0.6x1.801: 13(-4.321,1.633) 14(4.321,1.633)
  oval 1.001x1.6 hole 0.6x1.199: 15(-4.321,-2.547) 16(4.321,-2.547)
  rect 0.6x1.45 smd: A1B12(-3.226,2.547) A4B9(-2.451,2.547) B1A12(3.22,2.547) B4A9(2.451,2.547)
  rect 0.299x1.45 smd: A5(-1.25,2.547) A6(-0.249,2.547) A7(0.249,2.547) A8(1.25,2.547) B5(1.75,2.547) B6(0.75,2.547) B7(-0.75,2.547) B8(-1.75,2.547)

## Nets
As in the schematic, except:
GND: C2.1 C8.1 C9.1 C11.2 C12.1 C13.2 C14.2 C15.1 C16.2 C17.1 C18.1 C19.1 C20.1 C21.1 C22.1 C23.1 C24.1 C25.1 C26.1 C27.1 C28.1 DESIGNATOR1.2 H1.2 H2.2 H3.2 H4.2 LED2.1 Q1.2 Q2.2 Q3.2 R2.1 R17.1 R19.1 SW1.1 SW2.1 SW3.1 SW4.1 U3.3 U4.3 U6.49 U7.1 U8.1 U9.3 U10.3 U11.3 U13.1 USB1.A1B12 USB1.B1A12
ANT: C27.2 DESIGNATOR1.1 L1.1

Pads without a net: U2 3 5; U6 16 25 26 27 30 31 32 33 44 45 47 48; U7 2; U9 4 5 6; U10 5; U11 5; USB1 13 14 15 16 A5 A8 B5 B8

## Via types
v1: diameter 0.5, hole 0.3, Top Layer to Bottom Layer, 225 vias
v2: diameter 0.61, hole 0.305, Top Layer to Bottom Layer, 7 vias

## Routing (per net, layer and track width the routed paths; a pad name or vN(x,y) marks a point on that pad's centre or on a via; arc(x,y) is an arc through that point)
3V3: length 2.6
  Top Layer w0.635: C14.1 17.59,16.7 16.7,17.59 R8.2
+5V: length 97.9
  Top Layer w0.254: R3.1 30.74,19.81 26.92,19.81 25.78,18.67 25.78,8.43 U7.3
  Top Layer w0.305: 12.57,14.22 11.33,15.47 C12.2 10.57,18.13 9.31,19.39 USB1.B4A9 7.04,19.39 5.84,20.59 5.84,23.09 7.04,24.3 USB1.A4B9 9.11,24.3 10.54,22.86 11.94,22.86 12.23,23.16 U9.7
  Top Layer w0.635: U8.3 24.51,1.74 25.4,1.74 25.55,1.59
  Top Layer w1.016: 23.37,1.59 C16.1 46.67,1.59 51.48,6.4 U11.4
  Bottom Layer w0.305: v1(24.13,4.32) 22.48,5.97 16.76,5.97 16.51,6.22 16.51,12.57 14.99,14.1 v1(12.7,14.1)
  vias: v1(50.29,15.49) v1(50.29,13.34) v1(51.05,15.49) v1(51.05,13.34) v1(51.82,15.49) v1(51.82,13.34) v1(52.58,15.49) v1(52.58,13.34)
+12V: length 89.7
  Top Layer w0.305: H5.1 4.45,1.97 C22.2 5.17,3.9 5.97,4.7 8.13,4.7 8.93,3.9 C21.2 9.78,1.81 H6.1
  Bottom Layer w0.508: U10.4 76.75,3.86 75.95,3.05 11.01,3.05 H6.1
GND: length 149.7
  Top Layer w0.254: C26.1 7.65,11.87 SW4.1 ; 9.11,26.92 9.11,30.4 SW1.1 8.76,30.75 SW2.1 ; SW3.1 2.92,11.87 C25.1
  Top Layer w0.305: Q3.2 6.29,7.45 R19.1 ; 0.8,6.15 0.8,7.44 R17.1 ; U13.1 9.2,42.23 6.9,42.23 ; U9.3 11.73,19.13 12.42,18.44 C12.1
  Top Layer w0.635: v2(46.48,23.62) C20.1 47.41,22.52 48.13,23.24 U3.3 ; 28.19,21.37 25.65,21.37 ; 28.19,21.37 v2(28.19,22.23) ; 28.19,21.37 31.06,21.37 ; U7.1 20.69,6.3 C17.1 ; C19.1 47.51,27.72 48.36,28.58 v2(50.42,28.58) ; 31.06,21.37 R2.1 ; 31.06,21.37 Q1.2 ; H4.2 H2.2 H3.2 H1.2 ; U8.1 21.19,2.92 C15.1 ; C2.1 C9.1 ; 26.2,5.84 26.2,4.6 C24.1 26.25,3.53 C16.2 26.64,2.83 C23.1
  Top Layer w1.524: 27.05,4.45 45.59,4.45 47.42,6.27 U11.3
  Bottom Layer w0.635: U10.3 72.69,5.89 71.12,4.32 v1(43.94,4.32) v1(43.31,4.32) ; v2(50.42,28.58) 50.42,27.56 v2(46.48,23.62) 45.09,22.23 v2(28.19,22.23)
  vias: v1(1.65,24.38) v1(1.65,23.37) v1(1.65,22.35) v1(1.65,21.34) v1(1.65,20.32) v1(1.65,19.3) v1(2.92,24.38) v1(2.92,23.37) v1(2.92,22.35) v1(2.92,21.34) v1(2.92,20.32) v1(2.92,19.3) v1(3.94,8.76) v1(3.94,7.49) v1(3.94,6.35) v1(4.06,24.38) v1(4.06,23.37) v1(4.06,22.35) v1(4.06,21.34) v1(4.06,20.32) v1(4.06,19.3) v1(5.08,8.76) v1(5.08,7.62) v1(5.08,6.35) v1(8.51,38.23) v1(8.51,37.4) v1(8.51,36.57) v1(8.51,35.74) v1(9.27,38.23) v1(9.27,37.4) v1(9.27,36.57) v1(9.27,35.74) v1(9.6,13.53) v1(9.6,12.39) v1(9.6,11.12) v1(9.53,9.53) v1(9.53,8.38) v1(9.53,7.11) v1(10.03,38.23) v1(10.03,37.4) v1(10.03,36.57) v1(10.03,35.74) v1(10.16,17.27) v1(10.16,16.64) v1(10.67,9.53) v1(10.67,8.38) v1(10.67,7.11) v1(10.74,13.53) v1(10.74,12.39) v1(10.74,11.12) v1(10.92,36.58) v1(10.92,35.75) v1(11.05,40.26) v1(11.68,36.58) v1(11.68,35.75) v1(11.61,21.93) v1(12.06,39.62) v1(12.45,36.58) v1(12.44,35.75) v1(12.46,21.93) v1(13.2,39.1) v1(13.31,21.93) v1(13.78,39.69) v1(13.73,38.56) v1(14.27,38.03) v1(14.22,15.75) v1(14.32,39.15) v1(14.86,38.61) v1(15.11,16.64) v1(15.11,15.75) v1(15.75,38.35) v1(15.75,37.53) v1(15.75,36.58) v1(15.75,35.75) v1(16.38,14.61) v1(16.4,13.72) v1(16.51,38.35) v1(16.51,37.53) v1(16.51,36.58) v1(16.51,35.75) v1(17.27,38.35) v1(17.27,37.53) v1(17.27,36.58) v1(17.27,35.75) v1(17.4,33.53) v1(17.4,25.34) v1(17.4,24.51) v1(17.4,23.75) v1(18.03,25.34) v1(18.03,24.51) v1(18.03,23.75) v1(18.29,36.58) v1(18.29,35.81) v1(18.29,35.05) v1(18.8,23.75) v1(19.12,36.57) v1(19.12,35.81) v1(19.12,35.05) v1(19.94,5.21) v1(19.94,4.06) v1(20.05,39.99) v1(20.59,39.45) v1(20.64,40.57) v1(20.7,5.21) v1(20.7,4.06) v1(20.75,11.56) v1(20.75,10.8) v1(20.75,10.04) v1(21.18,40.04) v1(21.13,38.92) v1(21.58,11.56) v1(21.58,10.8) v1(21.58,10.04) v1(21.72,39.5) v1(22.16,37.34) v1(22.16,36.58) v1(22.16,35.81) v1(22.41,11.56) v1(22.41,10.8) v1(22.41,10.04) v1(22.99,37.33) v1(22.99,36.58) v1(22.99,35.81) v1(22.92,34.29) v1(22.92,33.53) v1(22.92,32.77) v1(22.92,30.73) v1(22.92,29.97) v1(22.92,29.21) v1(23.24,11.56) v1(23.24,10.8) v1(23.24,10.04) v1(23.75,34.28) v1(23.75,33.53) v1(23.75,32.77) v1(23.75,30.73) v1(23.75,29.97) v1(23.75,29.21) v1(25.53,24) v1(25.53,23.24) v1(25.53,22.48) v1(25.53,21.72) v1(27.18,5.97) v1(27.18,5.46) v1(27.18,4.95) v1(27.18,4.45) v1(27.18,3.94) v1(46.35,15.49) v1(46.35,13.34) v1(47.12,15.49) v1(47.12,13.34) v1(47.88,15.49) v1(47.88,13.34) v1(48.64,15.49) v1(48.64,13.34)
AC_L: length 74.2
  Top Layer w0.305: U3.2 v1(57.86,24.56) U4.1
  Top Layer w2.032: U5.2 61.81,41.53 U12.1
  Bottom Layer w0.381: U11.1 32.77,14.02 32.77,11.68 33.91,10.54 56.39,10.54 57.66,11.81 U10.1 57.86,14.61 v1(57.86,24.56) 57.86,37.54 59.4,39.08 U12.1
  vias: v1(31.12,15.49) v1(31.12,13.34) v1(31.88,15.49) v1(31.88,13.34) v1(32.64,15.49) v1(32.64,13.34) v1(33.4,15.49) v1(33.4,13.34) v1(56.52,15.49) v1(56.52,13.34) v1(57.28,15.49) v1(57.28,13.34) v1(58.04,15.49) v1(58.04,13.34) v1(58.8,15.49) v1(58.8,13.34)
AC_N: length 80.5
  Top Layer w0.254: 64.26,20.7 64.26,20.7 R4.1
  Top Layer w0.381: 64.26,17.53 U12.2 ; 64.26,17.53 42.93,17.53 39.8,14.4 U11.2 ; 64.26,17.53 64.26,15.18 U10.2
  Top Layer w1.016: 40.24,32.71 36.83,32.71
  Top Layer w2.032: D1.2 37.02,32.51 62.23,32.51 64.26,30.48 U12.2
  vias: v1(36.96,15.49) v1(36.96,13.34) v1(37.72,15.49) v1(37.72,13.34) v1(38.48,15.49) v1(38.48,13.34) v1(39.24,15.49) v1(39.24,13.34) v1(62.36,15.49) v1(62.36,13.34) v1(63.12,15.49) v1(63.12,13.34) v1(63.88,15.49) v1(63.88,13.34) v1(64.64,15.49) v1(64.64,13.34)
ANT: length 15.3
  Top Layer w0.305: L1.1 C27.2 16.51,32.35 arc(15.96,32.46) 15.49,32.77 arc(14.84,33.75) 14.61,34.91 14.61,35.53 arc(14.51,36.03) 14.22,36.45 13.5,37.17 arc(10.48,39.25) 6.9,40.12
DS18B20: length 27.2
  Top Layer w0.152: v1(22.48,21.59) 22.42,21.65 U6.36
  Top Layer w0.635: H1.3 H3.3 H2.3 H4.3
  Bottom Layer w0.152: H4.3 12.06,11.01 12.06,14.48 19.18,21.59 v1(22.48,21.59)
EN: length 11
  Top Layer w0.152: U6.9 17.8,29.82 17.27,30.35 13.22,30.35 SW1.2
  Top Layer w0.305: C8.2 R9.2 11.63,29.54 SW1.2
ESP_3V3: length 36.3
  Top Layer w0.203: 5.68,15.13 5.68,16.29 5.33,16.64 1.27,16.64 0.85,16.22 0.85,15.13
  Top Layer w0.254: 21.79,26.9 21.79,28.64 U6.1 ; 21.79,26.9 21.49,26.9 ; 21.79,26.9 U6.46 ; R9.1 13.21,28.19 13.46,27.94 13.46,25.27 13.84,24.9 U6.19 ; v1(6.48,14.86) 6.2,15.13 5.68,15.13 ; 21.49,26.9 21.49,25.93 22.02,25.4 U6.43 24.13,25.4 ; 21.49,26.9 20.8,27.59 U6.3 U6.4 ; U6.37 24.13,22.4
  Bottom Layer w0.254: v1(15.88,19.3) 11.43,14.86 v1(6.48,14.86)
ESP_RX0: length 13.4
  Top Layer w0.152: U6.40 21.36,23.9 v1(21.21,23.75) ; v1(11.81,25.91) 11.73,25.83 U9.8
  Bottom Layer w0.152: v1(11.81,25.91) 18.42,25.91 20.57,23.75 v1(21.21,23.75)
ESP_TX0: length 14.6
  Top Layer w0.152: U6.41 20.97,24.4 v1(20.95,24.38) ; v1(11.3,26.67) 11.23,26.6 U9.9
  Bottom Layer w0.152: v1(11.3,26.67) 18.67,26.67 v1(20.95,24.38)
KEY1: length 30.1
  Top Layer w0.152: v1(21.21,25.15) 21.46,24.9 U6.42
  Top Layer w0.203: R14.2 1.94,14.27 SW3.2
  Top Layer w0.254: SW3.2 3.29,15.62 v1(4.95,15.62) ; R14.2 C25.2
  Bottom Layer w0.152: v1(21.21,25.15) 22.35,24 22.35,23.62 21.97,23.24 18.16,23.24 10.92,16 8.26,16 7.87,15.62 v1(4.95,15.62)
KEY2: length 22
  Top Layer w0.152: U6.39 22.13,23.4 v1(21.46,22.73)
  Top Layer w0.203: R15.2 6.73,14.27 SW4.2
  Top Layer w0.254: SW4.2 8.1,15.49 v1(9.4,15.49) ; R15.2 C26.2
  Bottom Layer w0.152: v1(9.4,15.49) 11.05,15.49 18.29,22.73 v1(21.46,22.73)
MODULE_3V3: length 57.6
  Top Layer w0.635: U8.2 21,1.83 C15.2 18.06,1.83 H1.1 H3.1 H2.1 H4.1
  Bottom Layer w0.305: H4.1 24.64,17.18 24.64,37.59 19.43,42.8 13.97,42.8 U13.2
PWM1: length 18.2
  Top Layer w0.152: v1(24,26.04) 24.64,26.04 25.81,24.86 R1.1 ; v1(16.76,29.84) 16.3,29.38 U6.12
  Bottom Layer w0.152: v1(16.76,29.84) 18.42,28.19 18.42,27.56 20.32,25.65 20.86,25.65 21.24,26.04 v1(24,26.04)
PWM2: length 34.6
  Top Layer w0.152: U6.13 17.19,27.9 v1(17.27,27.81) ; v1(1.02,10.03) 1.02,9.25 R16.1
  Bottom Layer w0.152: v1(1.02,10.03) 3.81,10.03 4.06,10.29 4.06,16 4.83,16.76 8.51,16.76 9.02,17.27 9.02,25.91 10.92,27.81 v1(17.27,27.81)
PWM3: length 31.6
  Top Layer w0.152: R18.1 6.48,9.25 v1(6.48,10.03) ; U6.14 16.55,27.4 v1(16.64,27.31)
  Bottom Layer w0.152: v1(6.48,10.03) 4.83,10.03 4.47,10.39 4.47,15.82 4.91,16.26 8.89,16.26 9.4,16.76 9.4,25.65 11.05,27.31 v1(16.64,27.31)
SCL: length 22.6
  Top Layer w0.152: U6.34 20.8,22.12 20.07,22.86 v1(20.07,26.67)
  Bottom Layer w0.152: U13.3 15.88,41.4 20.07,37.21 v1(20.07,26.67)
SDA: length 21.6
  Top Layer w0.152: v1(20.83,26.42) 20.45,26.04 20.45,22.98 21.3,22.12 U6.35
  Bottom Layer w0.152: U13.4 20.83,38.23 v1(20.83,26.42)
UD+: length 7.5
  Top Layer w0.305: USB1.A6 9.53,22.09 10.73,20.89 U9.1 9.68,21.09 USB1.B6
UD-: length 8.3
  Top Layer w0.305: USB1.A7 7.88,21.59 6.86,21.59 6.6,21.84 6.6,22.35 6.85,22.59 USB1.B7 9.66,22.59 11.18,21.08 11.18,21.07 11.23,21.01 U9.2
ZERO_INT: length 49.1
  Top Layer w0.152: v1(23.37,17.02) 23.37,16.5 R5.1 23.74,16.13 v1(24.89,16.13) ; v1(23.37,23.11) 23.15,22.9 U6.38
  Top Layer w0.254: v1(45.59,21.34) 46.39,21.34 C20.2 46.48,20.7 46.74,20.45 48.31,20.45 U3.4 50.16,20.7 50.55,21.08 50.55,25.78 50.29,26.04 U4.4 48.31,25.78 46.74,25.78 46.61,25.91 C19.2
  Bottom Layer w0.152: v1(23.37,17.02) v1(23.37,23.11)
  Bottom Layer w0.254: v1(45.59,21.34) 27.81,21.34 25.4,18.92 25.4,16.64 v1(24.89,16.13)
$1N600: length 5.9
  Top Layer w0.635: 38.1,20.27 37.77,19.94 R3.2
$1N603: length 7.8
  Top Layer w0.635: U2.2 40.64,21.97 40.29,22.32 Q1.3
$1N629: length 3.6
  Top Layer w0.635: R2.2 31.56,23.07 31.76,23.27 Q1.1 32.32,23.61 R1.2
$1N976: length 12.8
  Top Layer w0.254: U3.1 R4.2 60.46,28.06 59.94,28.58 U4.2
$1N1155:
  vias: v2(33.91,29.72) v2(33.91,28.96) v2(44.45,29.97) v2(44.45,29.08)
$1N1347: length 16.5
  Top Layer w1.016: D1.3 32.27,41.78 30.99,41.78 29.97,40.77 29.97,29.97 30.61,29.34 R12.2
$1N1416: length 11.4
  Top Layer w1.016: D1.1 37.19,41.55 40.62,41.55
  Top Layer w2.032: 40.62,41.91 47.5,41.91 U5.1
$1N4532: length 2.9
  Top Layer w0.152: C11.1 10.73,26.39 U9.10
$1N4544: length 1.3
  Top Layer w0.305: LED2.2 20.4,18.42 R11.2
$1N12396: length 15.4
  Top Layer w0.152: v1(12.45,33.15) 12.45,33.91 SW2.2 ; v1(17.91,27.18) 17.53,27.18 16.51,26.16 16.51,23.38 16.03,22.9 U6.23
  Bottom Layer w0.152: v1(17.91,27.18) 17.91,27.9 12.66,33.15 v1(12.45,33.15)
$1N12986: length 3.2
  Top Layer w0.305: Q2.1 2.7,7.44 R17.2 R16.2
$1N13035: length 2.2
  Top Layer w0.305: H5.2 1.75,1.81 Q2.3
$1N13251: length 3.2
  Top Layer w0.305: R18.2 R19.2 8.19,7.45 Q3.1
$1N13257: length 2.2
  Top Layer w0.305: Q3.3 7.24,1.81 H6.2
$1N15091: length 5.3
  Top Layer w0.305: U6.2 arc(21.28,30.5) C28.2 arc(20.42,32.36) 19.62,32.39

## Copper pours and planes (outline as drawn; the poured copper is in the pictures)
3V3 on Top Layer: 17.15,16.76 17.25,16.66 22.52,16.66 22.52,12.45 17.15,12.45 17.15,12.45
+5V on Top Layer: 27.5,1.99 24.55,1.99 24.51,2.03 24.51,3.56 25.27,4.32 25.53,4.32 25.53,6.52 26.03,7.03 26.03,9.27 25.91,9.4 24.47,9.4 24.47,6.95 22.89,5.36 22.89,1.15 27.5,1.15
GND on Top Layer: 0,0 0,27.31 7.75,27.31 7.75,43.94 25.98,43.94 25.98,0
GND on Top Layer: 25.05,2.51 27.51,2.51 27.51,6.37 25.88,6.37 25.88,3.3 25.05,3.3
GND on Bottom Layer: 0,0 0,27.31 7.75,27.31 7.75,43.94 25.98,43.94 25.98,0
GND on Bottom Layer: 25.77,6.34 27.51,6.34 27.51,3.59 25.77,3.59 25.77,6.23
AC_N on Top Layer: 37.21,28.58 37.21,31.24 36.83,31.62 32.13,31.62 32.13,33.4 32.13,33.53 41.24,33.53 41.24,31.62 39.37,31.62 38.99,31.24 38.99,28.58
ESP_3V3 on Top Layer: 14.22,19.81 24.44,19.81 24.44,19.04 14.22,19.04
ESP_3V3 on Top Layer: 14.22,25.02 14.86,25.02 14.86,19.05 14.22,19.05
ESP_3V3 on Top Layer: 23.78,25.53 24.51,25.53 24.51,19.04 23.78,19.04
$1N1155 on Top Layer: 42.29,30.45 44.83,30.45 44.83,28.32 42.29,28.32
$1N1155 on Top Layer: 33.53,30.45 35.97,30.45 35.97,28.26 33.53,28.26
$1N1155 on Bottom Layer: 33.53,30.45 44.83,30.45 44.83,28.32 33.53,28.32
$1N1155 on Bottom Layer: 33.66,30.45 44.7,30.45 44.7,28.32 33.66,28.32
$1N1416 on Top Layer: 36.58,43.31 42.46,43.31 42.46,40.81 36.58,40.81

Small or netless copper shapes (teardrops, artwork), in the pictures only: 204 on Top Layer, 39 on Bottom Layer

## Text on the board
Top Silkscreen Layer: 12V | - + | S - +
